# EasyEDA schematic SCH_Minotaur Remote Controller_2024-04-17.json
TITLE: Sheet_1; REV: 1.0; Date: 2024-01-31; Sheet: 1/1; Drawn By: yasentsv; Company: Your Company
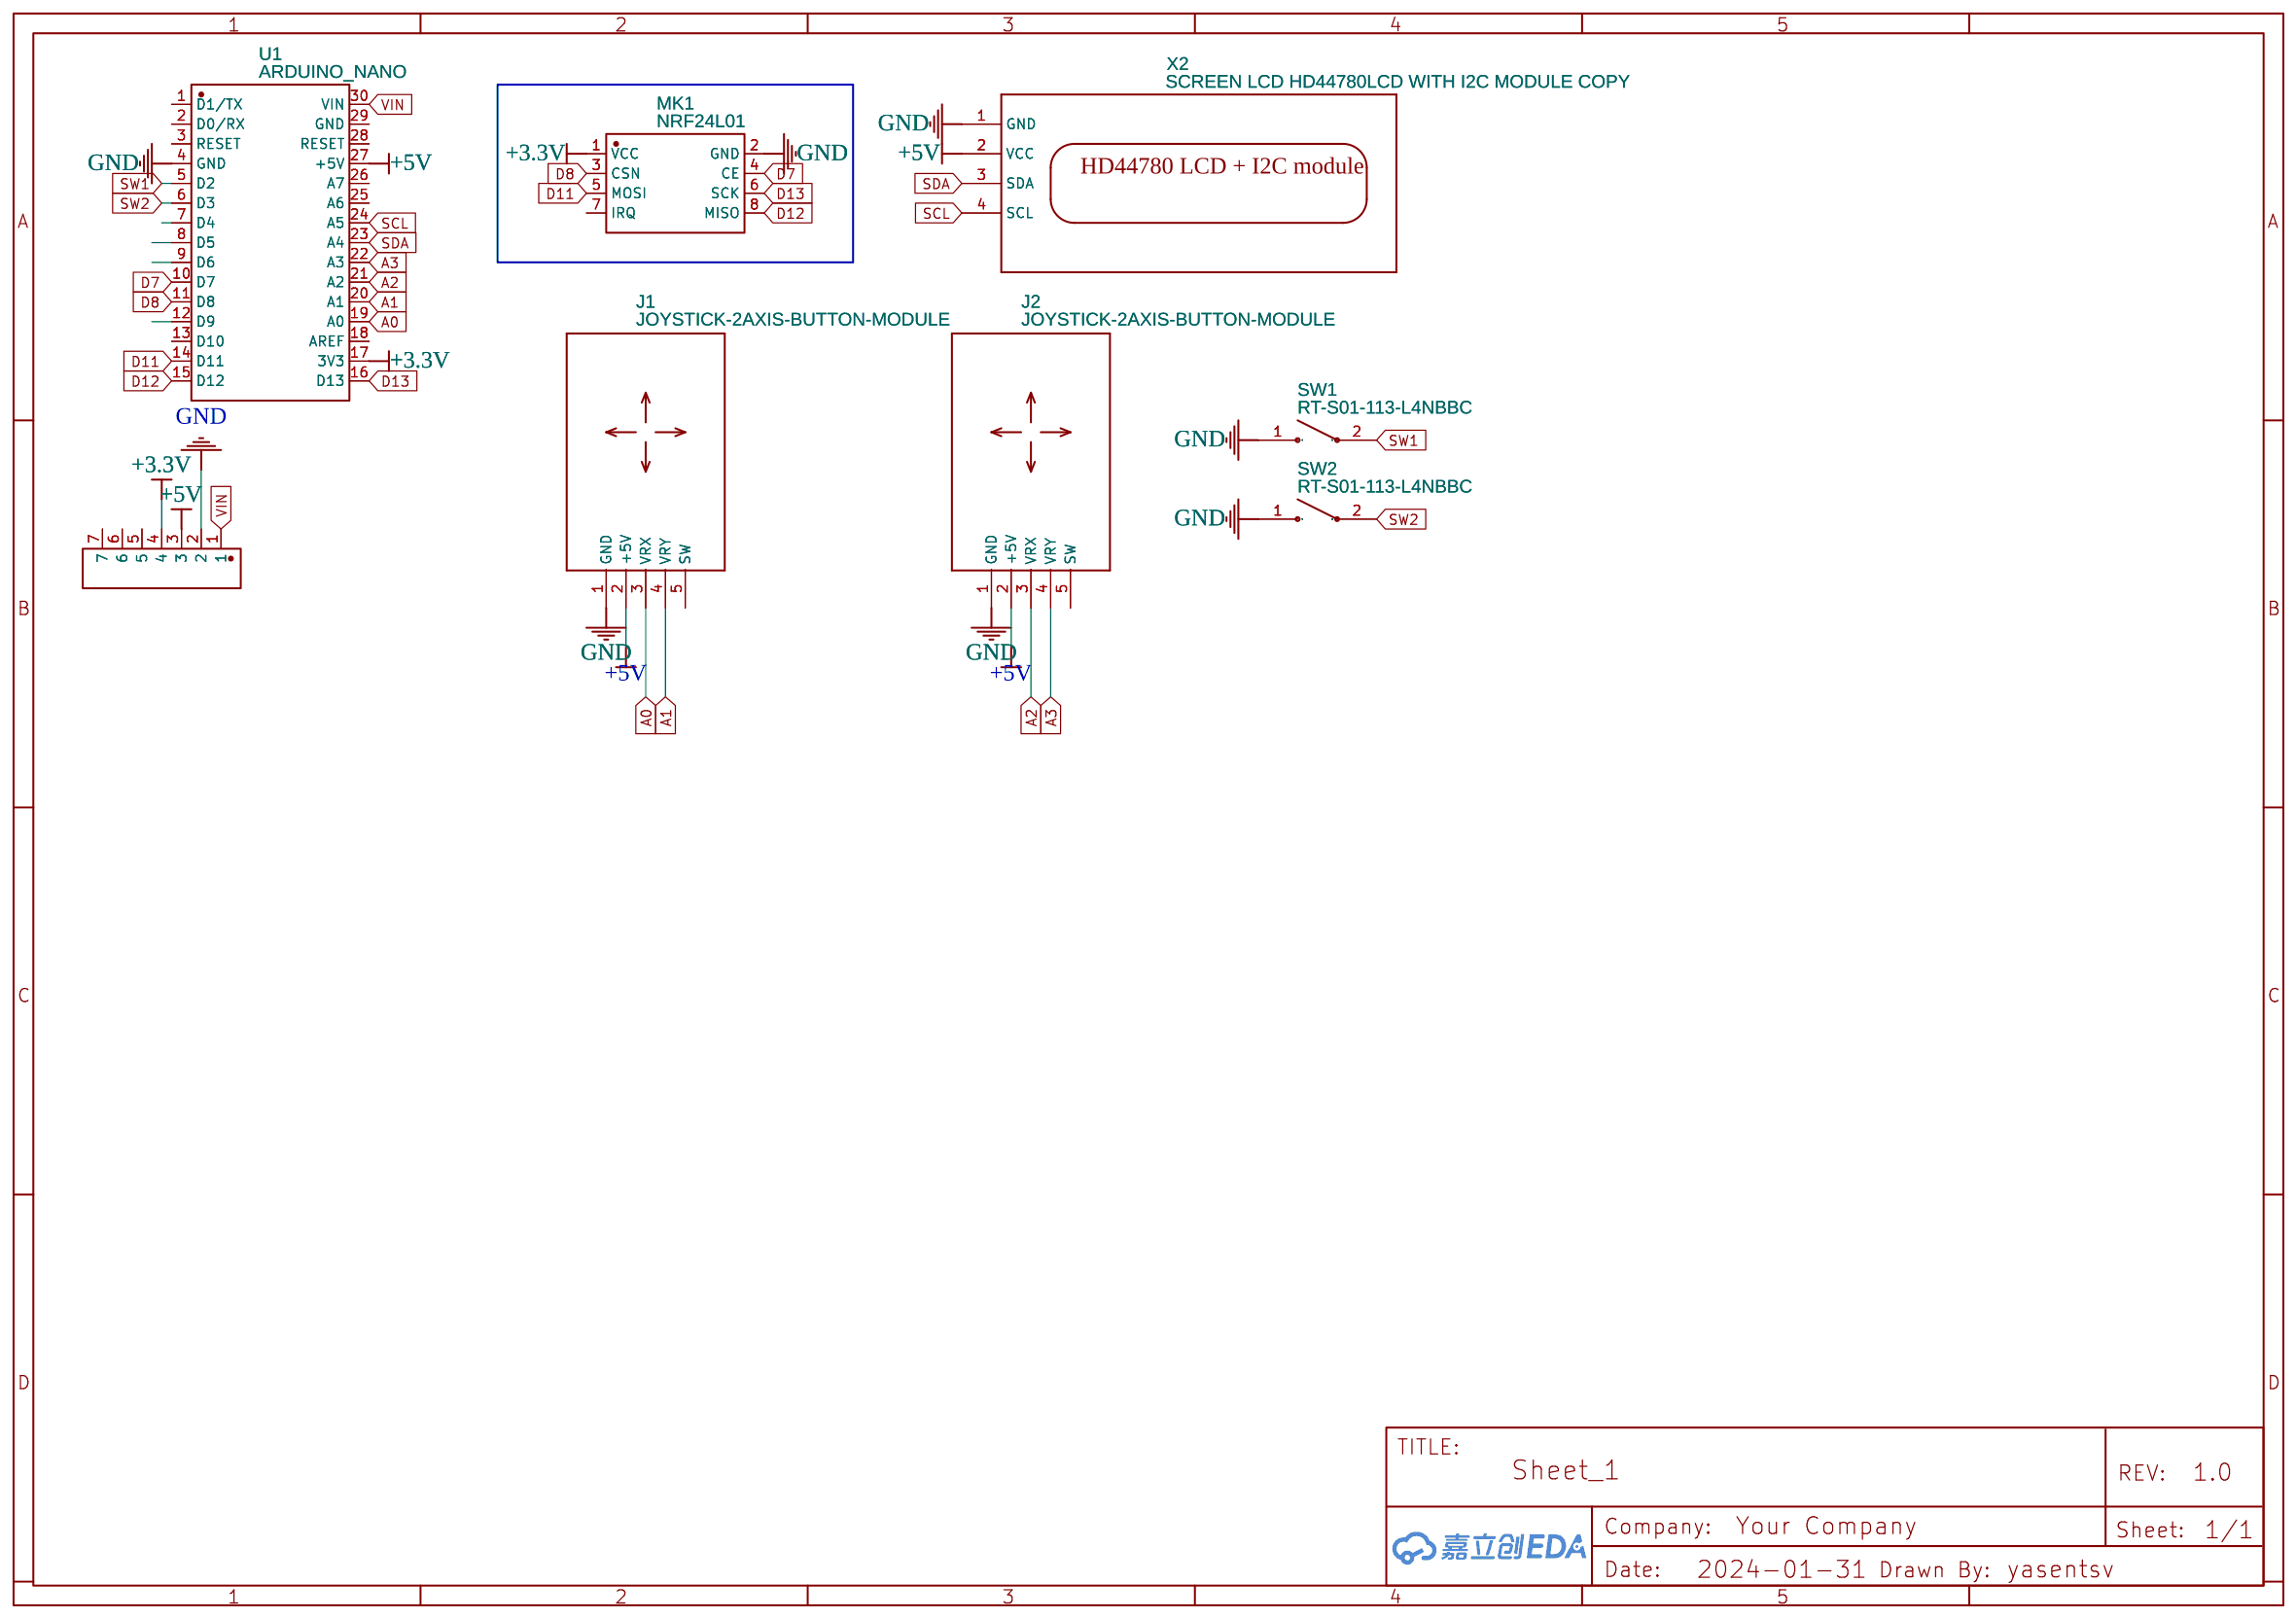
[diagram p0: schematic sheet]

## Parts
J1  JOYSTICK-2AXIS-BUTTON-MODULE  [JOYSTICK-2AXIS-BUTTON-MODULE]
J2  JOYSTICK-2AXIS-BUTTON-MODULE  [JOYSTICK-2AXIS-BUTTON-MODULE]
MK1  NRF24L01  [WIRELM-SMD_NRF24L01]
SW1  RT-S01-113-L4NBBC  [SW-TH_RT-S01-113-L4NBBC]
SW2  RT-S01-113-L4NBBC  [SW-TH_RT-S01-113-L4NBBC]
U1  ARDUINO_NANO  [COMM-TH_ARDUINO_NANO]
U4  2.54MM双塑胶单排直针,总长17MM  [HDR-TH_7P-P2.54-V-F_2.54MM-17MM]
X2  SCREEN LCD HD44780LCD WITH I2C MODULE COPY  [I2C LCD1602 I2C PCF8574AT]

## Library data of the parts
J1 J2 = JOYSTICK-2AXIS-BUTTON-MODULE: Contributor: arenda1234
MK1 = NRF24L01: Supplier: LCSC; Manufacturer: Ai-Thinker(安信可); Supplier Part: C90751; JLCPCB Part Class: Extended Part
SW1 SW2 = RT-S01-113-L4NBBC: Contributor: LCSC; Supplier: LCSC; Supplier Part: C309260; Manufacturer: ROCKTEK(富力隆); JLCPCB Part Class: Extended Part
U1 = ARDUINO_NANO: Contributor: lcsc; Supplier: LCSC; Supplier Part: C9900017879; Manufacturer: null; JLCPCB Part Class: Extended Part
U4 = 2.54MM双塑胶单排直针,总长17MM: Contributor: LCSC; Supplier: LCSC; Supplier Part: C9900001323; Manufacturer Part: 2.54mm双塑胶单排直针,总长17mm; JLCPCB Part Class: Extended Part; link: https://lcsc.com/eda_search?q=C9900001323&%26type=1&ref=editor
X2 = SCREEN LCD HD44780LCD WITH I2C MODULE COPY: Contributor: yucspcb

## Nets
+3.3V: MK1.1(VCC) U1.17(3V3) U4.4
+5V: J1.2(+5V) J2.2(+5V) U1.27(+5V) U4.3 X2.2(VCC)
GND: J1.1(GND) J2.1(GND) MK1.2(GND) SW1.1 SW2.1 U1.4(GND) U4.2 X2.1(GND)
VIN: U1.30(VIN) U4.1
A0: J1.3(VRX) U1.19(A0)
A1: J1.4(VRY) U1.20(A1)
A2: J2.3(VRX) U1.21(A2)
A3: J2.4(VRY) U1.22(A3)
D7: MK1.4(CE) U1.10(D7)
D8: MK1.3(CSN) U1.11(D8)
D11: MK1.5(MOSI) U1.14(D11)
D12: MK1.8(MISO) U1.15(D12)
D13: MK1.6(SCK) U1.16(D13)
SCL: U1.24(A5) X2.4(SCL)
SDA: U1.23(A4) X2.3(SDA)
SW1: SW1.2 U1.5(D2)
SW2: SW2.2 U1.6(D3)

Not connected (* = marked no-connect by the designer): J1 5(SW); J2 5(SW); MK1 7(IRQ); U1 1(D1/TX) 2(D0/RX) 3(RESET) 7(D4) 8(D5) 9(D6) 12(D9) 13(D10) 18(AREF) 25(A6) 26(A7) 28(RESET) 29(GND); U4 5 6 7
